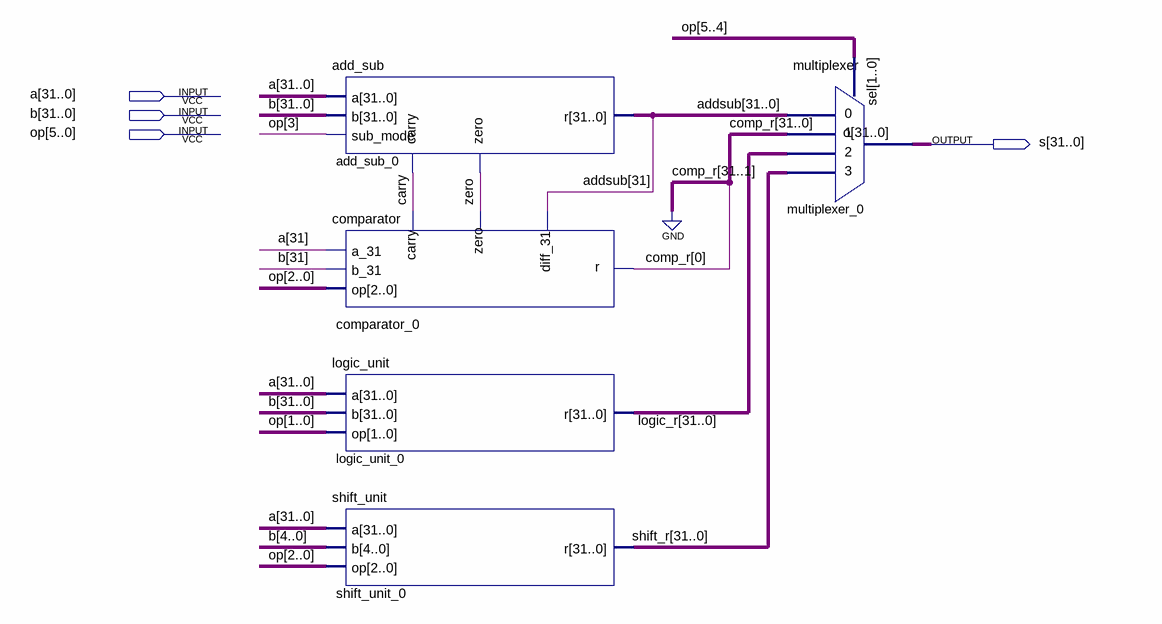
[diagram p0: schematic sheet]
// Quartus schematic ALU.bdf as structural Verilog: 5 symbols, 4 pins
module ALU (
  input  [31:0] a,
  input  [31:0] b,
  input  [5:0] op,
  output [31:0] s
);

  wire carry, zero;
  wire [0:0] comp_r;
  wire [31:0] addsub, logic_r, shift_r;

  add_sub add_sub_0 (.a(a), .b(b), .sub_mode(op[3]), .carry(carry), .zero(zero), .r(addsub));
  comparator comparator_0 (
    .carry(carry), .zero(zero), .op(op[2:0]), .a_31(a[31]), .b_31(b[31]), .diff_31(addsub[31]), .r(comp_r[0]));
  logic_unit logic_unit_0 (.a(a), .b(b), .op(op[1:0]), .r(logic_r));
  shift_unit shift_unit_0 (.a(a), .b(b[4:0]), .op(op[2:0]), .r(shift_r));
  multiplexer multiplexer_0 (
    .sel(op[5:4]), .i0(addsub), .i2(logic_r), .i1({{31{1'b0}}, comp_r[0]}), .i3(shift_r), .o(s));
endmodule
